# Altium project Motion_Board_V2.PrjPcb
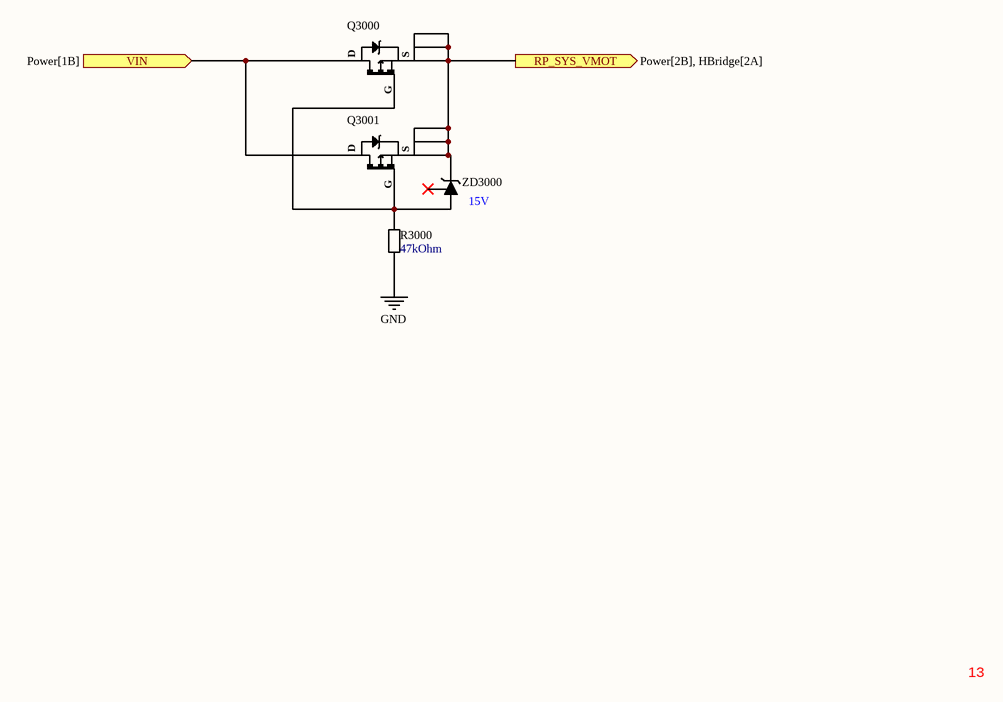
[diagram p0: REVERSE_PROTECTION.SchDoc]
9 sheets, 109 parts. Net scope: hierarchical (ports join the sheet entries above them; power ports are global).
Board file: Motion_Board_V2_PCB.PcbDoc
Sheets:
  REVERSE_PROTECTION.SchDoc
  5V0_SYS_SUPPLY.SchDoc
  Motors-Encoders.SchDoc
    HBridge1 = HBridge.SchDoc
    HBridge2 = HBridge.SchDoc
  PIC32MK.SchDoc
    Oscillator = Crystal.SchDoc
    U_MCLR = MCLR.SchDoc
  Communication.SchDoc
    U_CAN = CAN.SchDoc

## Sheet REVERSE_PROTECTION.SchDoc
size A4; SheetNumber: 3; SheetTotal: 13

### Parts
Q3000  SQJ659EP PMOS  [PowerPAK SO-8L SINGLE]  (value not drawn)
Q3001  SQJ659EP PMOS  [PowerPAK SO-8L SINGLE]  (value not drawn)
R3000  47kOhm  [RES_0603]
ZD3000  DZ23C15-E3-08 Zener Diode  [SOT95P245X96-3N]  (value not drawn)

### Ports
RP_SYS_VMOT (out, see Power[2B], HBridge[2A]), VIN (in, see Power[1B])

### Nets
GND: R3000.1
NetQ3000_D: Q3000.D Q3001.D ; port VIN
NetQ3000_G: Q3000.G Q3001.G R3000.2 ZD3000.1(Anode)
NetQ3000_S: Q3000.S(S1) Q3001.S(S1) ZD3000.3(Cathode) ; port RP_SYS_VMOT

Not connected (* = marked no-connect by the designer): ZD3000 2(Anode)*

### Notes on the sheet
- (near ZD3000) 15V
- 13

### Library data of the parts
Q3000 Q3001 = 00000005: P-Channel 60 V 52A (Tc) 83W (Tc) Surface Mount PowerPAK® SO-8; DigiKey Part Number: SQJ459EP-T1_GE3CT-ND; Mouser Part Number: 78-SQJ459EP-T2_BE3; ComponentLink1Description: DigiKey; ComponentLink1URL: https://www.digikey.com/en/products/detail/vishay-siliconix/SQJ459EP-T1-GE3/6708881; ComponentLink2Description: Mouser; ComponentLink2URL: https://eu.mouser.com/ProductDetail/Vishay-Siliconix/SQJ459EP-T2_BE3?qs=CiayqK2gdcKpg8h0vLRPjA%3D%3D
R3000 = R000010: 47 kOhms ±1% 0.1W, 1/10W Chip Resistor 0603 (1608 Metric) Moisture Resistant Thick Film; ComponentLink1Description: DigiKey; ComponentLink1URL: https://www.digikey.com/en/products/detail/yageo/RC0603FR-0747KL/727253; resistance: 47kOhm; DigiKey Part Number: 311-47.0KHRCT-ND
ZD3000 = 00000006: Zener Diode Array 1 Pair Common Cathode 15 V 300 mW ±5% SOT-23-3; DigiKey Part Number: 112-DZ23C15-E3-08CT-ND; ComponentLink1Description: DigiKey; ComponentLink1URL: https://www.digikey.com/en/products/detail/vishay-general-semiconductor-diodes-division/DZ23C15-E3-08/4831460

## Sheet 5V0_SYS_SUPPLY.SchDoc
size OrCAD B; SheetNumber: 4; SheetTotal: 13
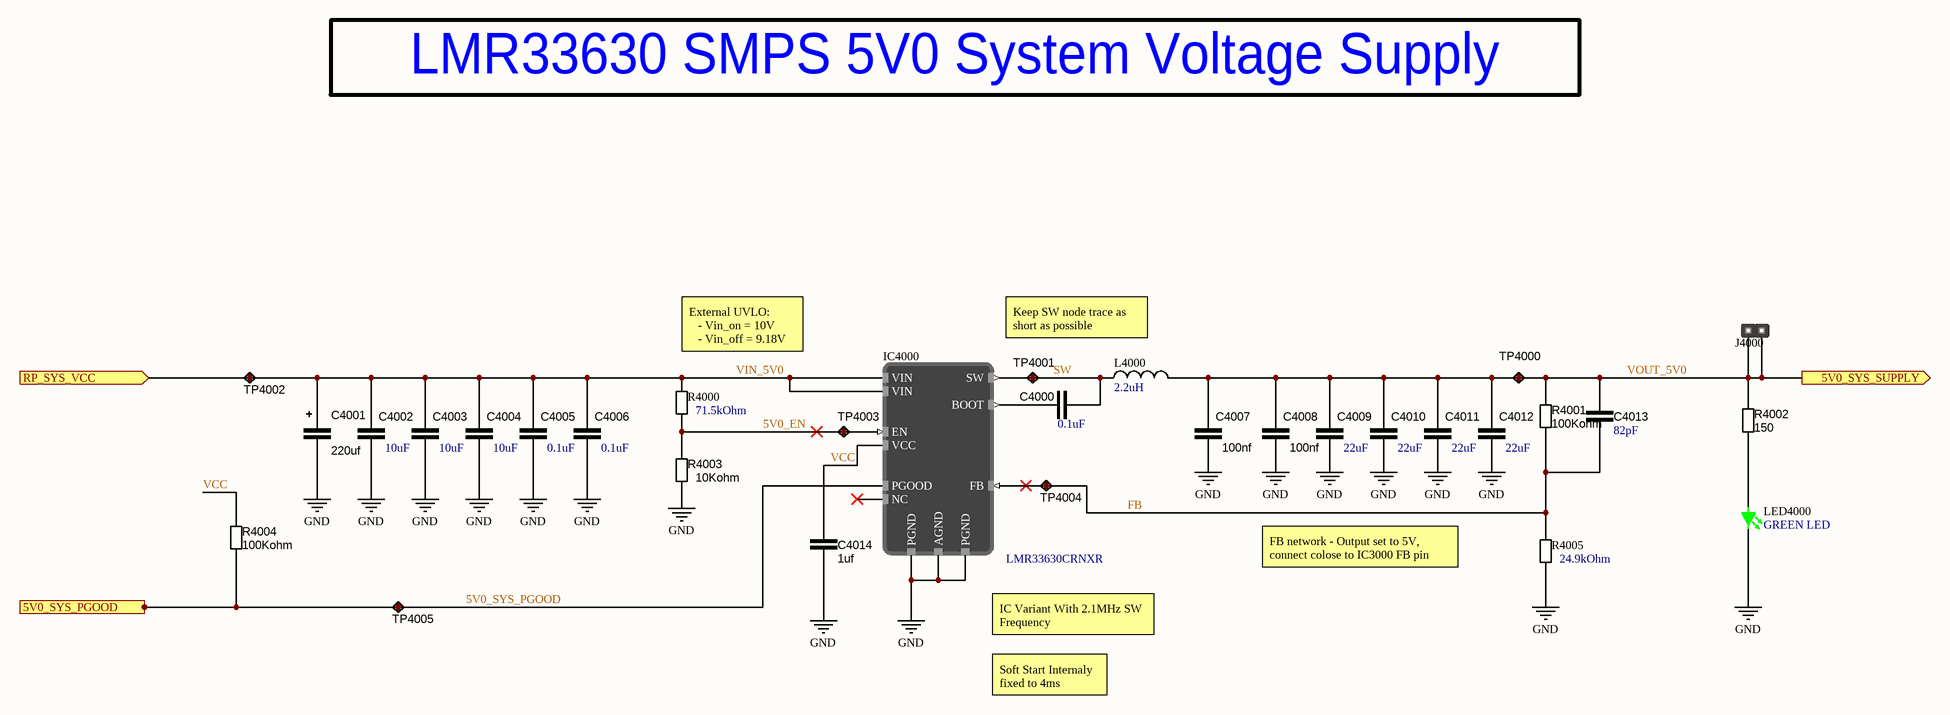
[diagram p1: 5V0_SYS_SUPPLY.SchDoc]

### Parts
C4000  0.1uF  [CAP_0603]
C4001  220uf  [CAPAE109103X103M]
C4002  10uF  [CAP_1206]
C4003  10uF  [CAP_1206]
C4004  10uF  [CAP_1206]
C4005  0.1uF  [CAP_0603]
C4006  0.1uF  [CAP_0603]
C4007  100nf  [CAP_0603]
C4008  100nf  [CAP_0603]
C4009  22uF  [CAP_1206]
C4010  22uF  [CAP_1206]
C4011  22uF  [CAP_1206]
C4012  22uF  [CAP_1206]
C4013  82pF  [CAP_0603]
C4014  1uf  [CAP_0603]
IC4000  LMR33630CRNXR  [VQFN-HR]
J4000  *  [HM1x2]  (value not drawn)
L4000  2.2uH  [INDP_518X518]
LED4000  GREEN LED  [DIOC1608X04N]
R4000  71.5kOhm  [RES_0603]
R4001  100Kohm  [RES_0603]
R4002  150  [RES_0603]
R4003  10Kohm  [RES_0603]
R4004  100Kohm  [RES_0603]
R4005  24.9kOhm  [RES_0603]
TP4000  Test point  [TestPoint]  (value not drawn)
TP4001  Test point  [TestPoint]  (value not drawn)
TP4002  Test point  [TestPoint]  (value not drawn)
TP4003  Test point  [TestPoint]  (value not drawn)
TP4004  Test point  [TestPoint]  (value not drawn)
TP4005  Test point  [TestPoint]  (value not drawn)

### Ports
5V0_SYS_PGOOD (out, see Power[2B]), 5V0_SYS_SUPPLY (out, see Power[3B]), RP_SYS_VCC (in, see Power[2B])

### Nets
GND: C4001.1 C4002.1 C4003.1 C4004.1 C4005.1 C4006.1 C4007.1 C4008.1 C4009.1 C4010.1 C4011.1 C4012.1 C4014.1 IC4000.1(PGND) IC4000.6(AGND) IC4000.11(PGND) LED4000.2 R4003.1 R4005.1
5V0_EN: IC4000.9(EN) R4000.1 R4003.2 TP4003.1  [project net 5V0_EN_4]
5V0_SYS_PGOOD: IC4000.8(PGOOD) R4004.1 TP4005.1 ; port 5V0_SYS_PGOOD
FB: C4013.1 IC4000.7(FB) R4001.1 R4005.2 TP4004.1  [project net FB_4]
SW: C4000.2 IC4000.12(SW) L4000.1 TP4001.1  [project net SW_4]
VCC: C4014.2 IC4000.5(VCC) R4004.2  [project net VCC_4]
VIN_5V0: C4001.2 C4002.2 C4003.2 C4004.2 C4005.2 C4006.2 IC4000.2(VIN) IC4000.10(VIN) R4000.2 TP4002.1 ; port RP_SYS_VCC
VOUT_5V0: C4007.2 C4008.2 C4009.2 C4010.2 C4011.2 C4012.2 C4013.2 J4000.1 J4000.2 L4000.2 R4001.2 R4002.2 TP4000.1 ; port 5V0_SYS_SUPPLY
NetC4000_1: C4000.1 IC4000.4(BOOT)
NetLED4000_1: LED4000.1 R4002.1

Not connected (* = marked no-connect by the designer): IC4000 3(NC)*

### Notes on the sheet
- LMR33630 SMPS 5V0 System Voltage Supply
- (near R4000) External UVLO:
  - Vin_on = 10V
  - Vin_off = 9.18V
- Keep SW node trace as short as possible
- FB network - Output set to 5V, connect colose to IC3000 FB pin
- (near IC4000) IC Variant With 2.1MHz SW Frequency
- Soft Start Internaly fixed to 4ms

### Library data of the parts
C4000 C4005 C4006 = C000018: CAP CER 0.1UF 50V X7R 0603; capacitance: 0.1uF; ComponentLink1Description: DigiKey; ComponentLink1URL: https://www.digikey.com/en/products/detail/samsung-electro-mechanics/CL10B104KB8NNNC/3886658; DigiKey Part Number: 1276-1000-1-ND
C4001 = C000019: CAP ALUM 220UF 20% 50V SMD; capaticanse: 220uf; ComponentLink1Description: digikey; ComponentLink1URL: https://www.digikey.com/en/products/detail/nichicon/UCW1H221MNL1GS/2549783; DigiKey part number: 493-9426-1-ND
C4002-C4004 = C000017: CAP CER 10UF 50V X7R 1206; capacitance: 10uF; ComponentLink1Description: DigiKey; ComponentLink1URL: https://www.digikey.com/en/products/detail/samsung-electro-mechanics/CL31B106KBHNNNE/5961251; DigiKey Part Number: 1276-6767-1-ND
C4007 C4008 = C000007: CAP CER 100nF 0603 25V X7R; capaticanse: 100nf; ComponentLink1Description: digikey; ComponentLink1URL: https://www.digikey.com/en/products/detail/kyocera-avx/06033C104K4T2A/8019250
C4009-C4012 = C000020: 22 µF ±10% 25V Ceramic Capacitor X5R 1206 (3216 Metric); capacitance: 22uF; ComponentLink1Description: DigiKey; ComponentLink1URL: https://www.digikey.com/en/products/detail/samsung-electro-mechanics/CL31A226KAHNNNE/3888705; DigiKey Part Number: 1276-3047-1-ND
C4013 = C000021: 82 pF ±1% 25V Ceramic Capacitor C0G, NP0 0603 (1608 Metric); capacitance: 82pF; ComponentLink1Description: DigiKey; ComponentLink1URL: https://www.digikey.com/en/products/detail/kyocera-avx/KGM15ACG1E820FT/1599315?s=N4IgjCBcoMxaBjKAzAhgGwM4FMA0IB7KAbXDBggF18AHAFyhAGU6AnASwDsBzEAX3xgALPBBJIaLHkIlwAVgCcAJiEB2ENRD1GLDj36CAbKPGSc%2BIpFIxlQ45u2RmbLrwEglABiEKTKDOYyViAAHEoABDQAYhq0DE4AqpzsdADyyACy2KiYAK6s2AYgALRKfpBsudKWpHIafA1AA; DigiKey Part Number: 478-KGM15ACG1E820FTCT-ND
C4014 = C000011: CAP CER 1uF 10V X7R 0603; capaticanse: 1uf; ComponentLink1Description: digikey; ComponentLink1URL: https://www.digikey.com/en/products/detail/samsung-electro-mechanics/CL10B105KP8NNNC/3887604; DigiKey part number: 1276-1946-2-ND
IC4000 = LMR33630CRNXR: Buck Switching Regulator IC Positive Adjustable 1V 1 Output 3A 12-PowerVFQFN; DigiKey Part Number: 296-49768-1-ND; ComponentLink1Description: DigiKey; ComponentLink1URL: https://www.digikey.com/en/products/detail/texas-instruments/LMR33630CRNXR/9356579; Mouser Part Number: 595-LMR33630CRNXR; ComponentLink2Description: Mouser; ComponentLink2URL: https://eu.mouser.com/ProductDetail/Texas-Instruments/LMR33630CRNXR?qs=55YtniHzbhDkvgzAIyvpfQ%3D%3D
J4000 = HEADER_1x2: Manufacturer Part Number: *
L4000 = L000012: FIXED IND 2.2UH 4.2A 50.1MOHM SM; inductance: 2.2uH; DigiKey Part Number: 541-1088-1-ND; ComponentLink1Description: DigiKey; ComponentLink1URL: https://www.digikey.com/en/products/detail/vishay-dale/IHLP2020BZER2R2M01/1869311?s=N4IgTCBcDaIJIAkAyAFMAGDAhAWgUQCUwiBZdARhAF0BfIA
LED4000 = 00000001: LED GREEN DIFFUSED 0603 SMD; Supplier 1: Avnet; Supplier Part Number 1: Q65111A3964; ComponentLink1Description: Digikey; ComponentLink1URL: https://www.digikey.com/en/products/detail/ams-osram-usa-inc/LG-Q396-PS-35/5249855
R4000 = R000022: 71.5 kOhms ±1% 0.1W, 1/10W Chip Resistor 0603 (1608 Metric) Moisture Resistant Thick Film; ComponentLink1Description: DigiKey; ComponentLink1URL: https://www.digikey.com/en/products/detail/yageo/RC0603FR-0771K5L/727370; resistance: 71.5kOhm; DigiKey Part Number: 311-71.5KHRCT-ND
R4001 R4004 = R000006: RES 100K OHM 1% 1/10W 0603; resistance: 100Kohm; ComponentLink1Description: digikey; ComponentLink1URL: https://www.digikey.com/en/products/detail/stackpole-electronics-inc/RMCF0603FG100K/1713543
R4002 = R000004: RES 150 OHM 1% 1/10W 0603; resistance: 1Kohm; ComponentLink1Description: digikey; ComponentLink1URL: https://www.digikey.com/en/products/detail/vishay-beyschlag-draloric-bc-components/MCT06030C1001FP500/2607821
R4003 = R000001: RES 10K OHM 1% 1/10W 0603; resistance: 10Kohm; ComponentLink1Description: digikey; ComponentLink1URL: https://www.digikey.com/en/products/detail/vishay-beyschlag-draloric-bc-components/MCT06030C1002FP500/1850440
R4005 = R000017: 24.9 kOhms ±1% 0.1W, 1/10W Chip Resistor 0603 (1608 Metric) Automotive AEC-Q200 Thick Film; ComponentLink1Description: DigiKey; ComponentLink1URL: https://www.digikey.com/en/products/detail/panasonic-electronic-components/ERJ-3EKF2492V/196236; resistance: 24.9kOhm; DigiKey Part Number: P24.9KHCT-ND
TP4000-TP4005 = TP002: Test point 1mm

## Sheet Motors-Encoders.SchDoc
size A4; SheetNumber: 6; SheetTotal: 13
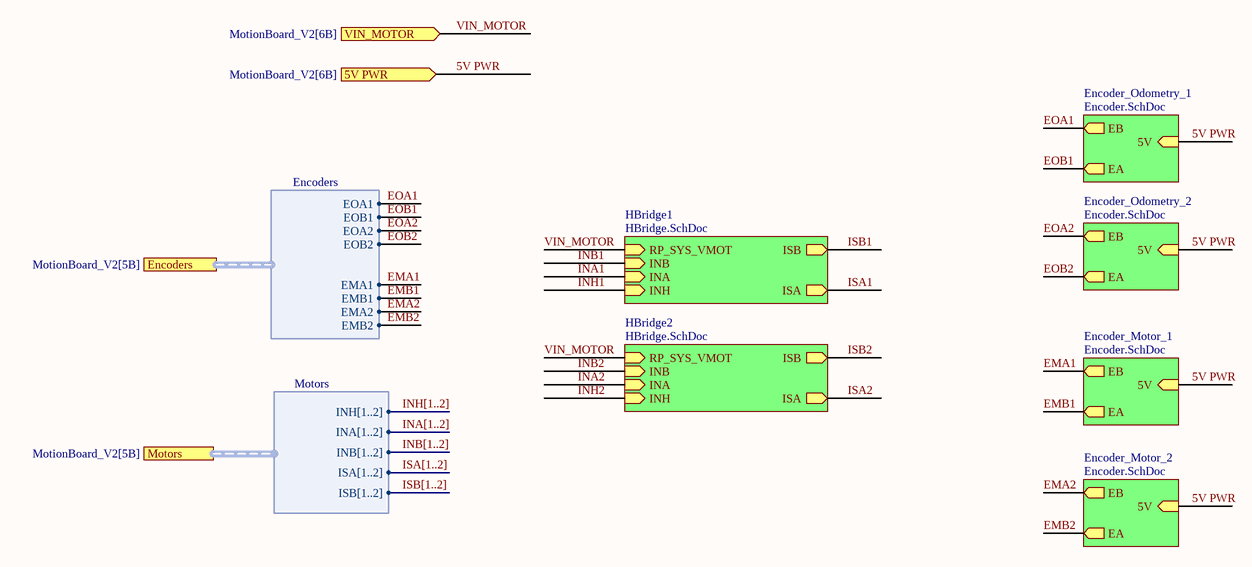
[diagram p2: Motors-Encoders.SchDoc]

### Sub-sheets
Encoder_Motor_1 = Encoder.SchDoc (file not in this document): EA (out), EB (out), 5V (in)
Encoder_Motor_2 = Encoder.SchDoc (file not in this document): EA (out), EB (out), 5V (in)
Encoder_Odometry_1 = Encoder.SchDoc (file not in this document): EA (out), EB (out), 5V (in)
Encoder_Odometry_2 = Encoder.SchDoc (file not in this document): EA (out), EB (out), 5V (in)
HBridge1 = HBridge.SchDoc: RP_SYS_VMOT (in), INB (in), ISB (out), ISA (out), INA (in), INH (in)
HBridge2 = HBridge.SchDoc: RP_SYS_VMOT (in), INB (in), ISB (out), ISA (out), INA (in), INH (in)

### Ports
5V PWR (in, see MotionBoard_V2[6B]), Encoders (harness Encoders, see MotionBoard_V2[5B]), Motors (harness Motors, see MotionBoard_V2[5B]), VIN_MOTOR (in, see MotionBoard_V2[6B])

### Harnesses
Encoders: EOA1, EOB1, EOA2, EOB2, EMA1, EMB1, EMA2, EMB2
Motors: INH[1..2], INA[1..2], INB[1..2], ISA[1..2], ISB[1..2]

### Nets
5V PWR: port 5V PWR, sheet Encoder_Odometry_2/5V, sheet Encoder_Motor_1/5V, sheet Encoder_Odometry_1/5V, sheet Encoder_Motor_2/5V
EMA1: sheet Encoder_Motor_1/EB, port Encoders.EMA1
EMA2: sheet Encoder_Motor_2/EB, port Encoders.EMA2
EMB1: sheet Encoder_Motor_1/EA, port Encoders.EMB1
EMB2: sheet Encoder_Motor_2/EA, port Encoders.EMB2
EOA1: sheet Encoder_Odometry_1/EB, port Encoders.EOA1
EOA2: sheet Encoder_Odometry_2/EB, port Encoders.EOA2
EOB1: sheet Encoder_Odometry_1/EA, port Encoders.EOB1
EOB2: sheet Encoder_Odometry_2/EA, port Encoders.EOB2
VIN_MOTOR: port VIN_MOTOR, sheet HBridge1/RP_SYS_VMOT, sheet HBridge2/RP_SYS_VMOT  [project net HBRIN]

### Buses and harness runs
bus INA[1..2]
bus INB[1..2]
bus INH[1..2]
bus ISA[1..2]
bus ISB[1..2]

## Sheet HBridge.SchDoc
size A4; SheetNumber: 8; SheetTotal: 13
Used 2 times, as channels HBridge1, HBridge2. Parts and nets are listed once, with the designators drawn on the sheet.
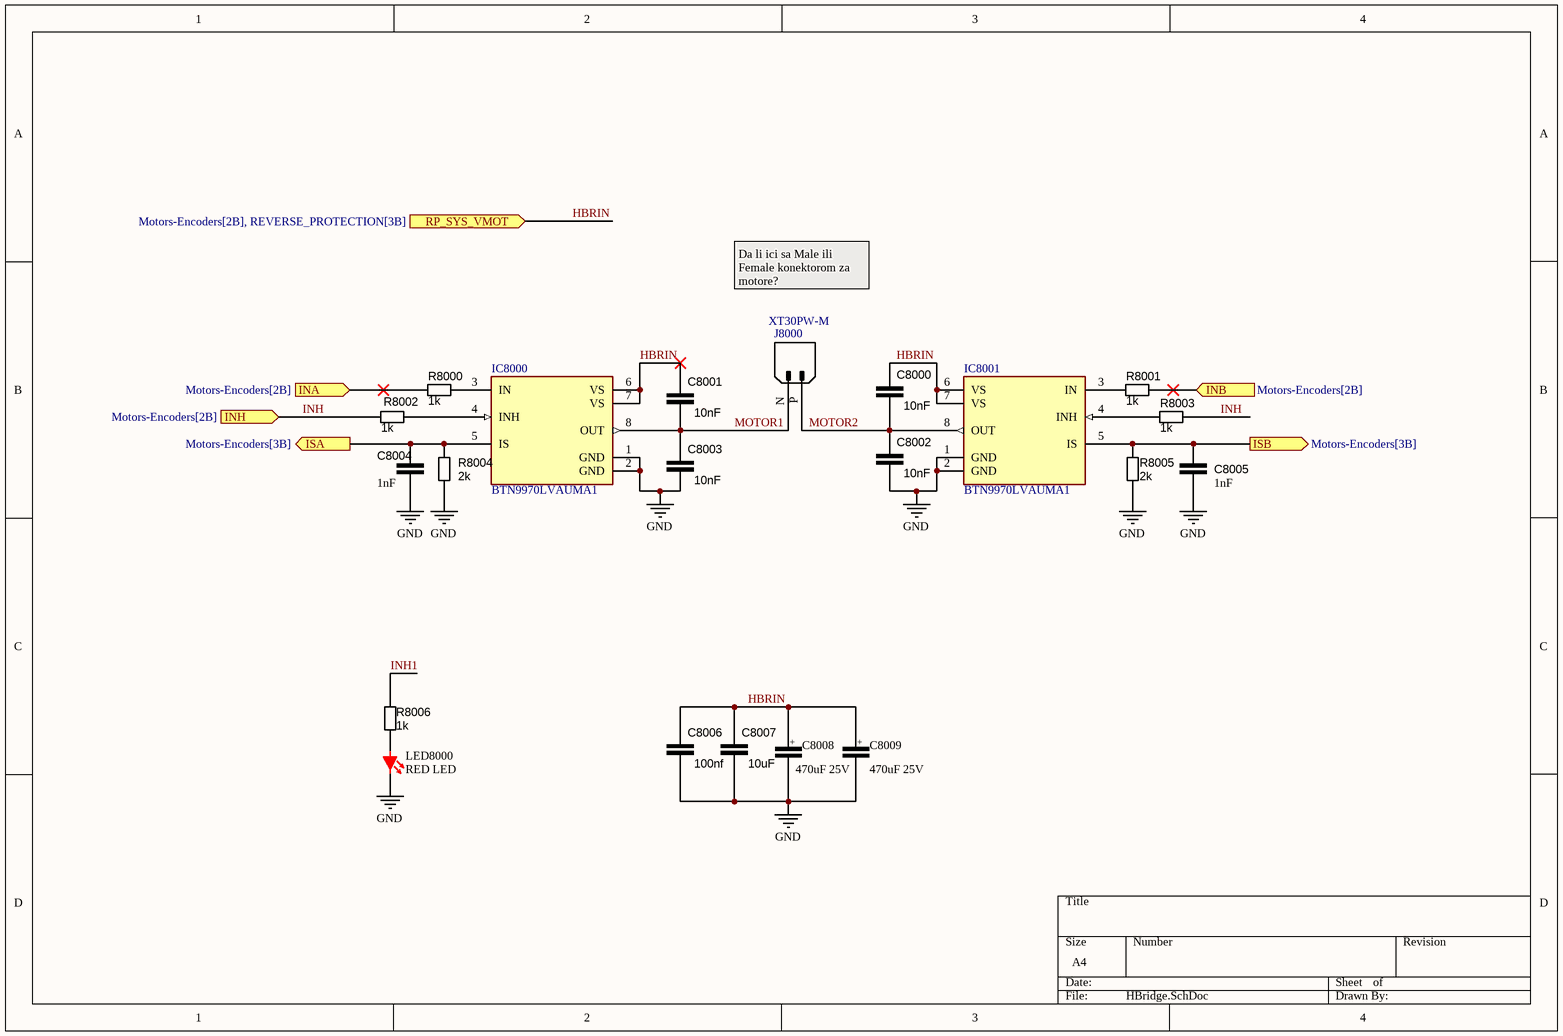
[diagram p3: HBridge.SchDoc]

### Parts
C8000  10nF  [CAP_0603]
C8001  10nF  [CAP_0603]
C8002  10nF  [CAP_0603]
C8003  10nF  [CAP_0603]
C8004  1nF  [CAP_0603]
C8005  1nF  [CAP_0603]
C8006  100nf  [CAP_0603]
C8007  10uF  [CAP_0603]
C8008  470uF 25V  [WCAP-ATG5_8X11.5(DXL)]
C8009  470uF 25V  [WCAP-ATG5_8X11.5(DXL)]
IC8000  BTN9970LVAUMA1  [FP-PG-HSOF-7-MFG]
IC8001  BTN9970LVAUMA1  [FP-PG-HSOF-7-MFG]
J8000  XT30PW-M  [AMASS_XT30PW-M]
LED8000  RED LED  [DIOC1608X04N]
R8000  1k  [RES_0603]
R8001  1k  [RES_0603]
R8002  1k  [RES_0603]
R8003  1k  [RES_0603]
R8004  2k  [RES_0603]
R8005  2k  [RES_0603]
R8006  1k  [RES_0603]

### Ports
INA (in, see Motors-Encoders[2B]), INB (in, see Motors-Encoders[2B]), INH (in, see Motors-Encoders[2B]), ISA (out, see Motors-Encoders[3B]), ISB (out, see Motors-Encoders[3B]), RP_SYS_VMOT (in, see Motors-Encoders[2B], REVERSE_PROTECTION[3B])

### Nets
GND: C8002.1 C8003.1 C8004.1 C8005.1 C8006.1 C8007.1 C8008.2(NEG) C8009.2(NEG) IC8000.1(GND) IC8000.2(GND) IC8001.1(GND) IC8001.2(GND) LED8000.2 R8004.2 R8005.2
HBRIN: C8000.2 C8001.2 C8006.2 C8007.2 C8008.1(POS) C8009.1(POS) IC8000.6(VS) IC8000.7(VS) IC8001.6(VS) IC8001.7(VS) ; port RP_SYS_VMOT
INA: R8000.2 ; port INA
INB: R8001.2 ; port INB
INH: R8002.2 R8003.2 ; port INH
INH1: R8006.1  [project net INH1_8]
ISA: C8004.2 IC8000.5(IS) R8004.1 ; port ISA
ISB: C8005.2 IC8001.5(IS) R8005.1 ; port ISB
MOTOR1: C8001.1 C8003.2 IC8000.8(OUT) J8000.N  [project net MOTOR1_8]
MOTOR2: C8000.1 C8002.2 IC8001.8(OUT) J8000.P  [project net MOTOR2_8]
NetIC8000_3: IC8000.3(IN) R8000.1
NetIC8000_4: IC8000.4(INH) R8002.1
NetIC8001_3: IC8001.3(IN) R8001.1
NetIC8001_4: IC8001.4(INH) R8003.1
NetLED8000_1: LED8000.1 R8006.2

### Channels
HBridge1: designators end in _HBridge1; ports INA=INA1 INB=INB1 INH=INH_HBridge1 ISA=ISA1 ISB=ISB1 RP_SYS_VMOT=HBRIN
HBridge2: designators end in _HBridge2; ports INA=INA2 INB=INB2 INH=INH_HBridge2 ISA=ISA2 ISB=ISB2 RP_SYS_VMOT=HBRIN

### Notes on the sheet
- Da li ici sa Male ili Female konektorom za motore?
- (in symbol WCAP-ATG5_8X11.5) +

### Library data of the parts
C8000-C8003 C8006 C8007 = C000007: CAP CER 100nF 0603 25V X7R; capaticanse: 100nf; ComponentLink1Description: digikey; ComponentLink1URL: https://www.digikey.com/en/products/detail/kyocera-avx/06033C104K4T2A/8019250
C8004 C8005 = C000021: 82 pF ±1% 25V Ceramic Capacitor C0G, NP0 0603 (1608 Metric); capacitance: 82pF; ComponentLink1Description: DigiKey; ComponentLink1URL: https://www.digikey.com/en/products/detail/kyocera-avx/KGM15ACG1E820FT/1599315?s=N4IgjCBcoMxaBjKAzAhgGwM4FMA0IB7KAbXDBggF18AHAFyhAGU6AnASwDsBzEAX3xgALPBBJIaLHkIlwAVgCcAJiEB2ENRD1GLDj36CAbKPGSc%2BIpFIxlQ45u2RmbLrwEglABiEKTKDOYyViAAHEoABDQAYhq0DE4AqpzsdADyyACy2KiYAK6s2AYgALRKfpBsudKWpHIafA1AA; DigiKey Part Number: 478-KGM15ACG1E820FTCT-ND
C8008 C8009 = WCAP-ATG5_8X11.5: <b>WCAP-ATG5 Aluminium Electrolytic Capacitors </B><BR><BR> <B>General Purpose +105 Â°C </B><BR><BR> <B>Characteristics</B><BR> <BR>General purpose product series with max. operating temperature of +105 Â°C  <BR>Mounting style: THT Radial  <BR>Capacitance range: 0.1 ÂµF â€’ 18000 ÂµF  <BR>Capacitance tolerance: Â±20 %  <BR>Operating temperature:  <BR>-40 Â°C up to +105 Â°C for UR < 400 V(DC)  <BR>-25 Â°C up to +105 Â°C for UR â‰¥ 400 V(DC)  <BR>Endurance: 2000 h @ +105 Â°C  <BR>Dimensions (DxL) in mm: 5.0 x 11.0 up to 22.0 x 31.0  <BR>Recommended soldering: Wave soldering  <BR> <BR> <B>Applications</B><BR> <BR>Filtering  <BR>Smoothing  <BR>Energy storage  <BR>Coupling  e.g. Switched-mode power supply, AC/DC converter, adapter, charger, digital camera  <BR> <BR><BR> <BR> <br><a href="https://www.we-online.com/catalog/media/o683503v209%20family-wcap-atg5-860020672004.jpg" title="Enlarge picture"> <img src="https://www.we-online.com/catalog/media/o683503v209%20family-wcap-atg5-860020672004.jpg"  width="320"></a><p> </b><br>             Details see: <a href="www.we-online.com/catalog/WCAP-ATG5/?utm_source=eagle_model&utm_medium=description_link&utm_campaign=eisos_eagle">www.we-online.com/catalog/WCAP-ATG5</a><p> Updated by yingchun,Shan;2020-02-28 <br>2020(C) WÃ¼rth Elektronik; MF: {'manufacturer': u'W\xfcrth Elektronik'}; MP: 860020474014; Package: None; Price: None; Value: *; Availability: Unavailable
IC8000 IC8001 = CMP-32854-000022-1: DC_MOTOR_CONTROL PG-HSOF-7
J8000 = XT30PW-M: MF: {'manufacturer': u'AMASS'}; Package: None; Price: None; Value: *; MP: XT30PW-M; Availability: Unavailable
LED8000 = 00000008: LED RED DIFFUSED 0603 SMD; Supplier 1: Avnet; Supplier Part Number 1: Q65111A3964; ComponentLink1Description: Digikey; ComponentLink1URL: https://www.digikey.com/en/products/detail/ams-osram-usa-inc/LG-Q396-PS-35/5249855
R8000-R8006 = R000004: as R4002 on sheet 5V0_SYS_SUPPLY; ComponentLink1Description: digikey; ComponentLink1URL: https://www.digikey.com/en/products/detail/vishay-beyschlag-draloric-bc-components/MCT06030C1001FP500/2607821

## Sheet PIC32MK.SchDoc
size A4; SheetNumber: 9; SheetTotal: 13
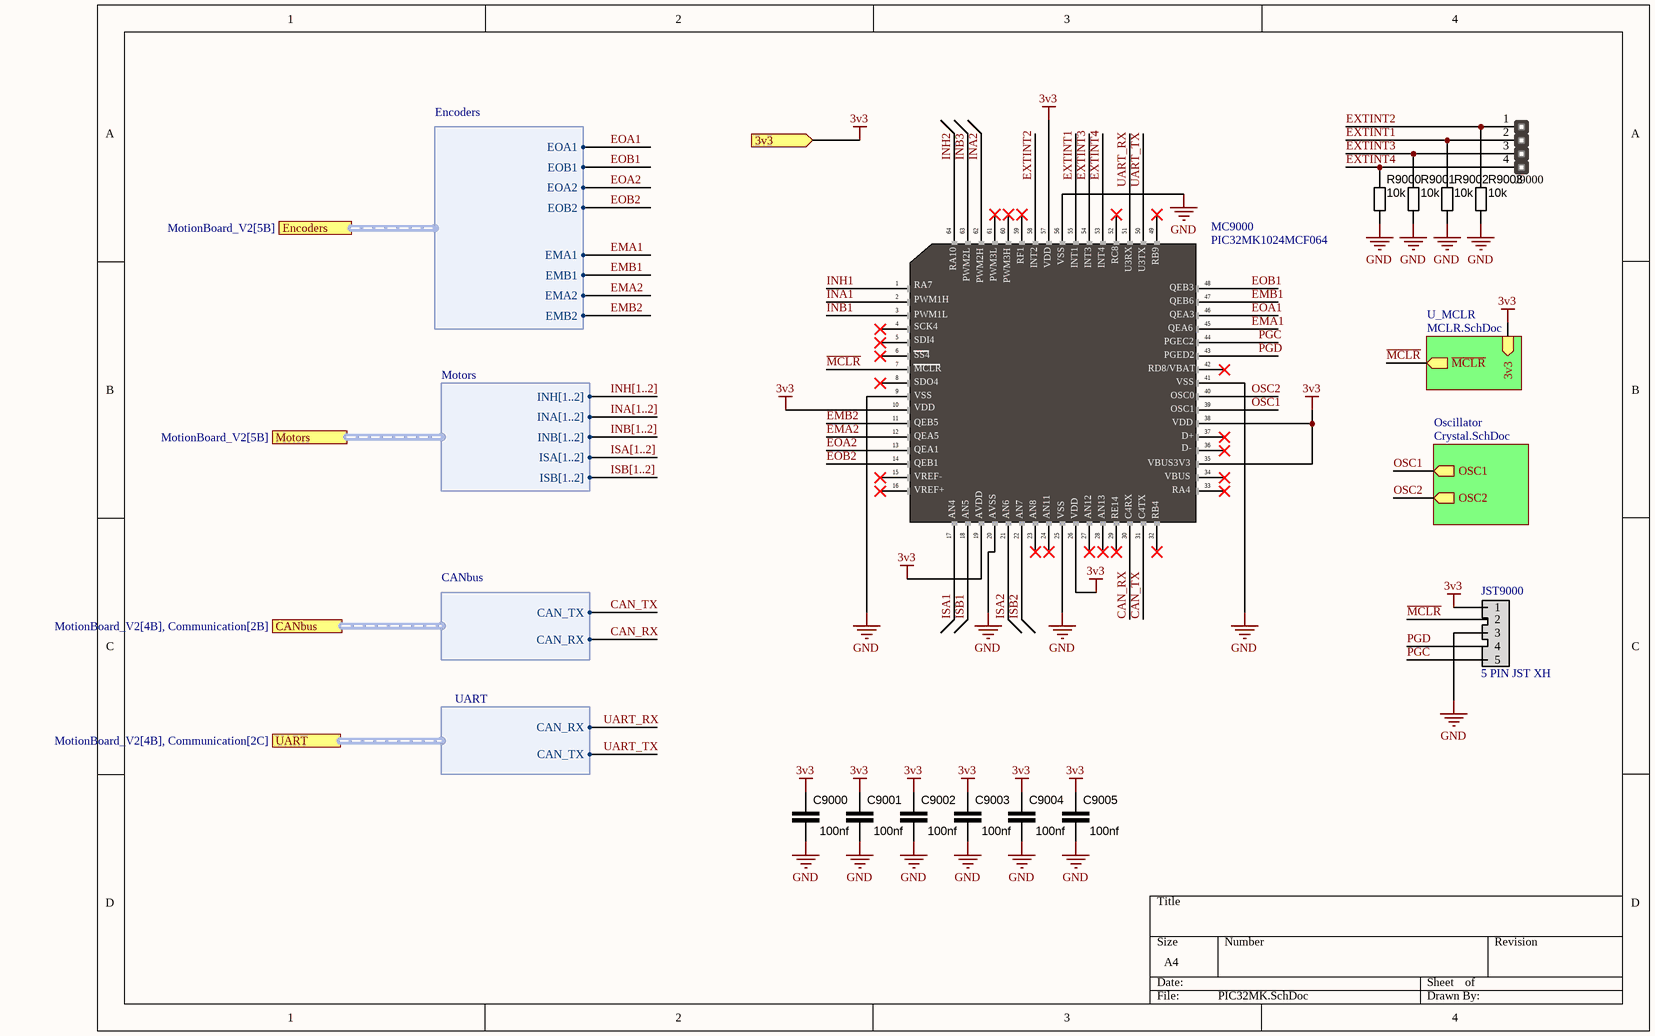
[diagram p4: PIC32MK.SchDoc]

### Parts
C9000  100nf  [CAP_0603]
C9001  100nf  [CAP_0603]
C9002  100nf  [CAP_0603]
C9003  100nf  [CAP_0603]
C9004  100nf  [CAP_0603]
C9005  100nf  [CAP_0603]
J9000  EXTINT  [HM1X4]  (value not drawn)
JST9000  5 PIN JST XH  [JST5PIN]
MC9000  PIC32MK1024MCF064  [PIC32MK_64-TQFP]
R9000  10k  [RES_0603]
R9001  10k  [RES_0603]
R9002  10k  [RES_0603]
R9003  10k  [RES_0603]

### Sub-sheets
Oscillator = Crystal.SchDoc: OSC1 (out), OSC2 (out)
U_MCLR = MCLR.SchDoc: ~{MCLR} (out), 3v3 (in)

### Ports
3v3 (in, see MotionBoard_V2[4B], CAN[2B], Communication[3B], LDO[2B], MCLR[3B], Power[2B]), CANbus (harness CANbus, see MotionBoard_V2[4B], Communication[2B]), Encoders (harness Encoders, see MotionBoard_V2[5B]), Motors (harness Motors, see MotionBoard_V2[5B]), UART (harness UART, see MotionBoard_V2[4B], Communication[2C])

### Harnesses
Motors: INH[1..2], INA[1..2], INB[1..2], ISA[1..2], ISB[1..2]
CANbus: CAN_TX, CAN_RX
UART: CAN_RX, CAN_TX
Encoders: EOA1, EOB1, EOA2, EOB2, EMA1, EMB1, EMA2, EMB2

### Nets
3v3: C9000.2 C9001.2 C9002.2 C9003.2 C9004.2 C9005.2 JST9000.1 MC9000.10 MC9000.19 MC9000.26 MC9000.35 MC9000.38 MC9000.57 ; port 3v3, sheet U_MCLR/3v3
GND: C9000.1 C9001.1 C9002.1 C9003.1 C9004.1 C9005.1 JST9000.3 MC9000.9 MC9000.20 MC9000.25 MC9000.41 MC9000.56 R9000.1 R9001.1 R9002.1 R9003.1
~{MCLR}: JST9000.2 MC9000.7 ; sheet U_MCLR/~{MCLR}
CAN_RX: MC9000.30 ; port CANbus.CAN_RX
CAN_TX: MC9000.31 ; port CANbus.CAN_TX
EMA1: MC9000.45 ; port Encoders.EMA1
EMA2: MC9000.12 ; port Encoders.EMA2
EMB1: MC9000.47 ; port Encoders.EMB1
EMB2: MC9000.11 ; port Encoders.EMB2
EOA1: MC9000.46 ; port Encoders.EOA1
EOA2: MC9000.13 ; port Encoders.EOA2
EOB1: MC9000.48 ; port Encoders.EOB1
EOB2: MC9000.14 ; port Encoders.EOB2
EXTINT1: J9000.2 MC9000.55 R9002.2  [project net EXTINT1_9]
EXTINT2: J9000.1 MC9000.58 R9003.2  [project net EXTINT2_9]
EXTINT3: J9000.3 MC9000.54 R9001.2  [project net EXTINT3_9]
EXTINT4: J9000.4 MC9000.53 R9000.2  [project net EXTINT4_9]
INA1: MC9000.2  [project net INA1_9]
INA2: MC9000.62  [project net INA2_9]
INB1: MC9000.3  [project net INB1_9]
INB3: MC9000.63  [project net INB3_9]
INH1: MC9000.1  [project net INH1_9]
INH2: MC9000.64  [project net INH2_9]
ISA1: MC9000.17  [project net ISA1_9]
ISA2: MC9000.21  [project net ISA2_9]
ISB1: MC9000.18  [project net ISB1_9]
ISB2: MC9000.22  [project net ISB2_9]
OSC1: MC9000.39 ; sheet Oscillator/OSC1
OSC2: MC9000.40 ; sheet Oscillator/OSC2
PGC: JST9000.5 MC9000.44  [project net PGC_9]
PGD: JST9000.4 MC9000.43  [project net PGD_9]
UART_RX: MC9000.51 ; port UART.CAN_RX
UART_TX: MC9000.50 ; port UART.CAN_TX

Not connected (* = marked no-connect by the designer): MC9000 4* 5* 6* 8* 15* 16* 23* 24* 27* 28* 29* 32* 33* 34* 36* 37* 42* 49* 52* 59* 60* 61*

### Buses and harness runs
bus INA[1..2]
bus INB[1..2]
bus INH[1..2]
bus ISA[1..2]
bus ISB[1..2]

### Notes on the sheet
- (in symbol PIC32MK) RF1; RC8; RA10; INT2; VDD; VSS; INT1; INT3; INT4; RB9; U3RX; U3TX; PWM2L; PWM2H; PWM3L; PWM3H; RA7; QEB3; PWM1H; QEB6; PWM1L; QEA3; SCK4; QEA6; SDI4; PGEC2; SS4; PGED2; MCLR; RD8/VBAT; SDO4; OSC0; OSC1; QEB5; QEA5; D+; QEA1; D-; QEB1; VBUS3V3; VREF-; VBUS; VREF+; RA4; AN4; AN5; AVDD; AVSS; AN6; AN7; AN8; AN11; AN12; AN13; RE14; C4RX; C4TX; RB4

### Library data of the parts
C9000-C9005 = C000007: CAP CER 100nF 0603 25V X7R; capaticanse: 100nf; ComponentLink1Description: digikey; ComponentLink1URL: https://www.digikey.com/en/products/detail/kyocera-avx/06033C104K4T2A/8019250
J9000 = HEADER_1x4_1
JST9000 = JST5PIN: 5 PIN JST XH 2.5mm pitch
MC9000 = PIC32MK: PIC32 Motor Control Microcontroller / PIC32MK1024MCF064 / PIC32MK1024MCM064 / Compatible
R9000-R9003 = R000001: RES 10K OHM 1% 1/10W 0603; resistance: 10Kohm; ComponentLink1Description: digikey; ComponentLink1URL: https://www.digikey.com/en/products/detail/vishay-beyschlag-draloric-bc-components/MCT06030C1002FP500/1850440

## Sheet Crystal.SchDoc
size A4; SheetNumber: 11; SheetTotal: 13
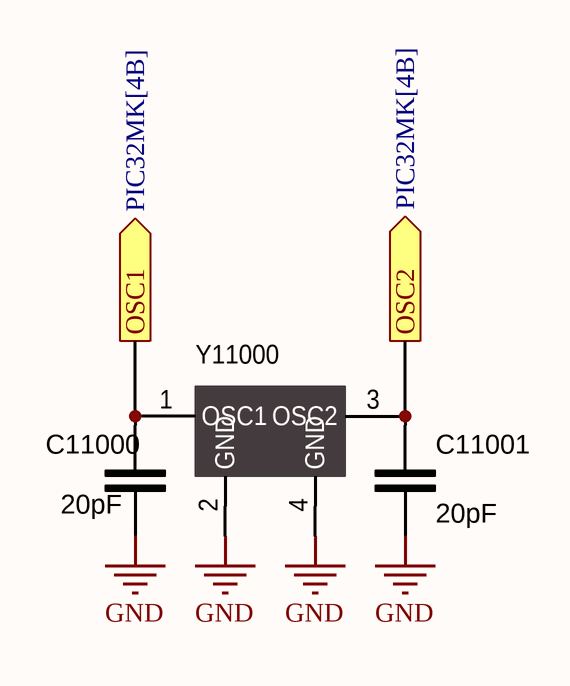
[diagram p5: Crystal.SchDoc]

### Parts
C11000  20pF  [CAP_0603]
C11001  20pF  [CAP_0603]
Y11000  8Hz  [ABM10]  (value not drawn)

### Ports
OSC1 (out, see PIC32MK[4B]), OSC2 (out, see PIC32MK[4B])

### Nets
GND: C11000.2 C11001.2 Y11000.2(GND) Y11000.4(GND)
OSC1: C11000.1 Y11000.1(OSC1) ; port OSC1
OSC2: C11001.1 Y11000.3(OSC2) ; port OSC2

### Library data of the parts
C11000 C11001 = C000007: CAP CER 100nF 0603 25V X7R; capaticanse: 100nf; ComponentLink1Description: digikey; ComponentLink1URL: https://www.digikey.com/en/products/detail/kyocera-avx/06033C104K4T2A/8019250
Y11000 = QUARTZ_8MHz: CRYSTAL 8.0000MHZ 18PF SMD; Manufacturer: ABRACON; Manufacturer Part Number: ABMM2-8.000MHZ-E2-T; id: 17; Frequency Stability: ±30ppm; Equivalent Series Resistance: 72 Ohm; item_id: 4360; Category: Crystals and Oscillators; Assembly: SMD; Datasheet URL: http://www.abracon.com/Resonators/ABMM2.pdf; Package Case: 4-SMD, No Lead (DFN, LCC); Frequency: 8Hz; Frequency Tolerance: ±30ppm; Load Capacitance: 18pF; Family: CRYSTAL; Size Dimension: 0.126" L x 0.098" W (3.20mm x 2.50mm); Part Type: Crystals, Oscillators

## Sheet MCLR.SchDoc
size A4; SheetNumber: 10; SheetTotal: 13
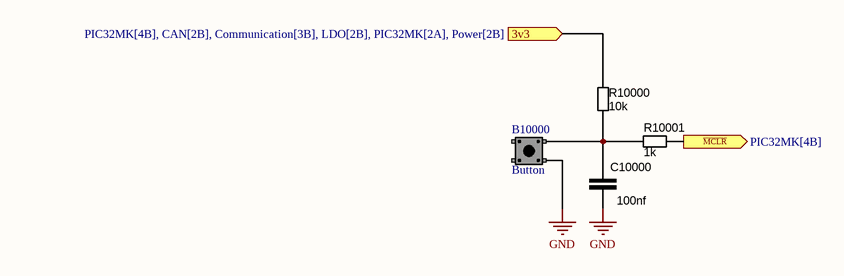
[diagram p6: MCLR.SchDoc]

### Parts
B10000  Button  [ButtonSMD]
C10000  100nf  [CAP_0603]
R10000  10k  [RES_0603]
R10001  1k  [RES_0603]

### Ports
3v3 (in, see PIC32MK[4B], CAN[2B], Communication[3B], LDO[2B], PIC32MK[2A], Power[2B]), ~{MCLR} (out, see PIC32MK[4B])

### Nets
3v3: R10000.2 ; port 3v3
GND: B10000.2 C10000.1
~{MCLR}: R10001.1 ; port ~{MCLR}
NetB10000_1: B10000.1 C10000.2 R10000.1 R10001.2

### Library data of the parts
B10000 = Button: 4 Pin Button
C10000 = C000007: CAP CER 100nF 0603 25V X7R; capaticanse: 100nf; ComponentLink1Description: digikey; ComponentLink1URL: https://www.digikey.com/en/products/detail/kyocera-avx/06033C104K4T2A/8019250
R10000 R10001 = R000006: RES 100K OHM 1% 1/10W 0603; resistance: 100Kohm; ComponentLink1Description: digikey; ComponentLink1URL: https://www.digikey.com/en/products/detail/stackpole-electronics-inc/RMCF0603FG100K/1713543

## Sheet Communication.SchDoc
size A4; SheetNumber: 12; SheetTotal: 13
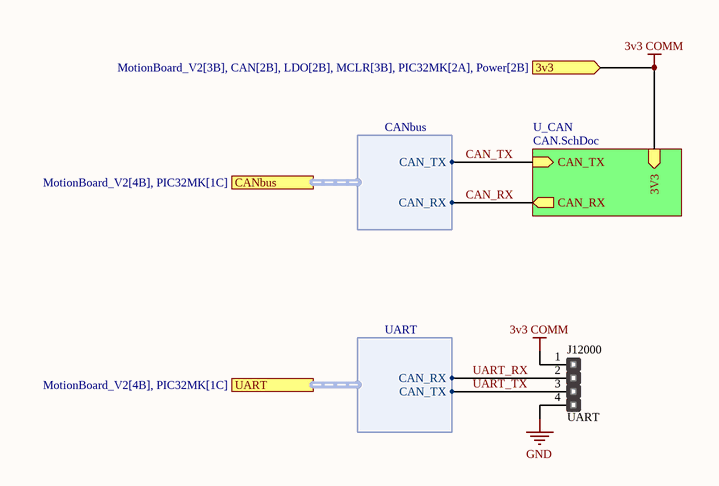
[diagram p7: Communication.SchDoc]

### Parts
J12000  UART  [HM1X4]

### Sub-sheets
U_CAN = CAN.SchDoc: CAN_TX (in), CAN_RX (out), 3V3 (in)

### Ports
3v3 (in, see MotionBoard_V2[3B], CAN[2B], LDO[2B], MCLR[3B], PIC32MK[2A], Power[2B]), CANbus (harness CANbus, see MotionBoard_V2[4B], PIC32MK[1C]), UART (harness UART, see MotionBoard_V2[4B], PIC32MK[1C])

### Harnesses
UART: CAN_RX, CAN_TX
CANbus: CAN_RX, CAN_TX

### Nets
3v3 COMM: J12000.1 ; port 3v3, sheet U_CAN/3V3  [project net 3v3 CAN]
GND: J12000.4
CAN_RX: sheet U_CAN/CAN_RX, port CANbus.CAN_RX
CAN_TX: sheet U_CAN/CAN_TX, port CANbus.CAN_TX
UART_RX: J12000.2 ; port UART.CAN_RX
UART_TX: J12000.3 ; port UART.CAN_TX

### Library data of the parts
J12000 = HEADER_1x4

## Sheet CAN.SchDoc
size A4; SheetNumber: 13; SheetTotal: 13
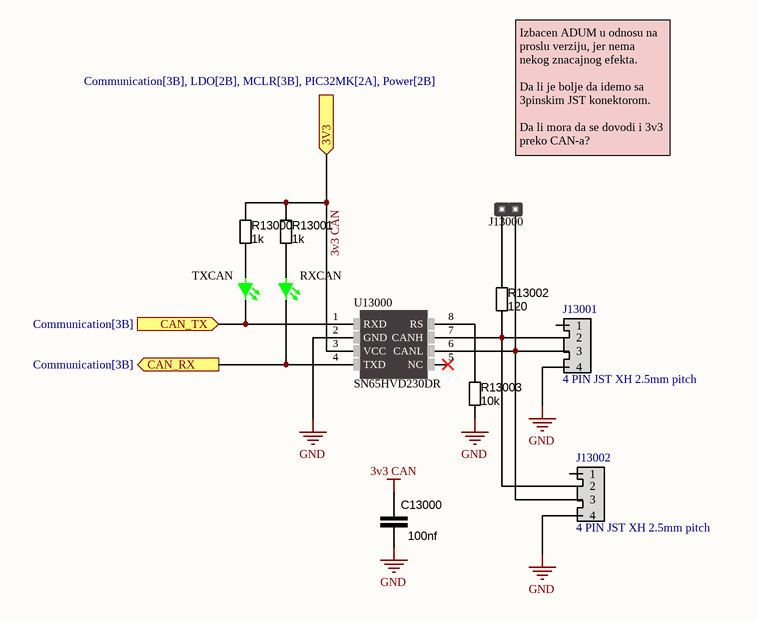
[diagram p8: CAN.SchDoc]

### Parts
C13000  100nf  [CAP_0603]
J13000  *  [HM1x2]  (value not drawn)
J13001  4 PIN JST XH 2.5mm pitch  [JST4PIN]
J13002  4 PIN JST XH 2.5mm pitch  [JST4PIN]
R13000  1k  [RES_0603]
R13001  1k  [RES_0603]
R13002  120  [RES_0603]
R13003  10k  [RES_0603]
RXCAN  GREEN LED  [DIOC1608X04N]  (value not drawn)
TXCAN  GREEN LED  [DIOC1608X04N]  (value not drawn)
U13000  SN65HVD230DR  [SOIC-8]

### Ports
3V3 (in, see Communication[3B], LDO[2B], MCLR[3B], PIC32MK[2A], Power[2B]), CAN_RX (out, see Communication[3B]), CAN_TX (in, see Communication[3B])

### Nets
3v3 CAN: C13000.2 R13000.2 R13001.2 U13000.3(VCC) ; port 3V3
GND: C13000.1 J13001.4 J13002.4 R13003.1 U13000.2(GND)
CAN_RX: RXCAN.2 U13000.4(TXD) ; port CAN_RX
CAN_TX: TXCAN.2 U13000.1(RXD) ; port CAN_TX
NetJ13000_1: J13000.1 R13002.2
NetJ13000_2: J13000.2 J13001.3 J13002.3 U13000.6(CANL)
NetJ13001_2: J13001.2 J13002.2 R13002.1 U13000.7(CANH)
NetR13000_1: R13000.1 TXCAN.1
NetR13001_1: R13001.1 RXCAN.1
NetR13003_2: R13003.2 U13000.8(RS)

Not connected (* = marked no-connect by the designer): J13001 1; J13002 1; U13000 5(NC)*

### Notes on the sheet
- Izbacen ADUM u odnosu na proslu verziju, jer nema nekog znacajnog efekta.
  Da li je bolje da idemo sa 3pinskim JST konektorom.
  Da li mora da se dovodi i 3v3 preko CAN-a?

### Library data of the parts
C13000 = C000007: CAP CER 100nF 0603 25V X7R; capaticanse: 100nf; ComponentLink1Description: digikey; ComponentLink1URL: https://www.digikey.com/en/products/detail/kyocera-avx/06033C104K4T2A/8019250
J13000 = HEADER_1x2: Manufacturer Part Number: *
J13001 J13002 = JST4PIN
R13000 R13001 = R000004: RES 1k OHM 1% 1/10W 0603; resistance: 1Kohm; ComponentLink1Description: digikey; ComponentLink1URL: https://www.digikey.com/en/products/detail/vishay-beyschlag-draloric-bc-components/MCT06030C1001FP500/2607821
R13002 = R000004: RES 120 OHM 1% 1/10W 0603; resistance: 1Kohm; ComponentLink1Description: digikey; ComponentLink1URL: https://www.digikey.com/en/products/detail/vishay-beyschlag-draloric-bc-components/MCT06030C1001FP500/2607821
R13003 = R000004: RES 10k OHM 1% 1/10W 0603; resistance: 1Kohm; ComponentLink1Description: digikey; ComponentLink1URL: https://www.digikey.com/en/products/detail/vishay-beyschlag-draloric-bc-components/MCT06030C1001FP500/2607821
RXCAN TXCAN = 00000001: LED GREEN DIFFUSED 0603 SMD; Supplier 1: Avnet; Supplier Part Number 1: Q65111A3964; ComponentLink1Description: Digikey; ComponentLink1URL: https://www.digikey.com/en/products/detail/ams-osram-usa-inc/LG-Q396-PS-35/5249855
U13000 = SN65HVD230: IC EMC CAN TRANSCEIVER 8-SOIC; Assembly: SMD; Barcode: 00000001; Manufacturer Part Number: SN65HVD230DR; Comet Product Page: http://store.comet.rs/Catalogue/Product/9057/; Datasheet Link: http://www.ti.com/lit/ds/symlink/sn65hvd232.pdf; Category: Integrated Circuits (ICs); Package: SOIC-8; Family: Comunication

## Nets that join several sheets
3v3: PIC32MK (13 pins), MCLR (R10000.2)
3v3 CAN: Communication (J12000.1), CAN (C13000.2 R13000.2 R13001.2 U13000.3)
GND: REVERSE_PROTECTION (R3000.1), 5V0_SYS_SUPPLY (19 pins), HBridge1 (15 pins), HBridge2 (15 pins), PIC32MK (16 pins), Crystal (C11000.2 C11001.2 Y11000.2 Y11000.4), MCLR (B10000.2 C10000.1), Communication (J12000.4), CAN (5 pins)
~{MCLR}: PIC32MK (JST9000.2 MC9000.7), MCLR (R10001.1)
HBRIN: HBridge1 (10 pins), HBridge2 (10 pins)
OSC1: PIC32MK (MC9000.39), Crystal (C11000.1 Y11000.1)
OSC2: PIC32MK (MC9000.40), Crystal (C11001.1 Y11000.3)